# EAGLE design 1 byte input (EAGLE 9.5.0)
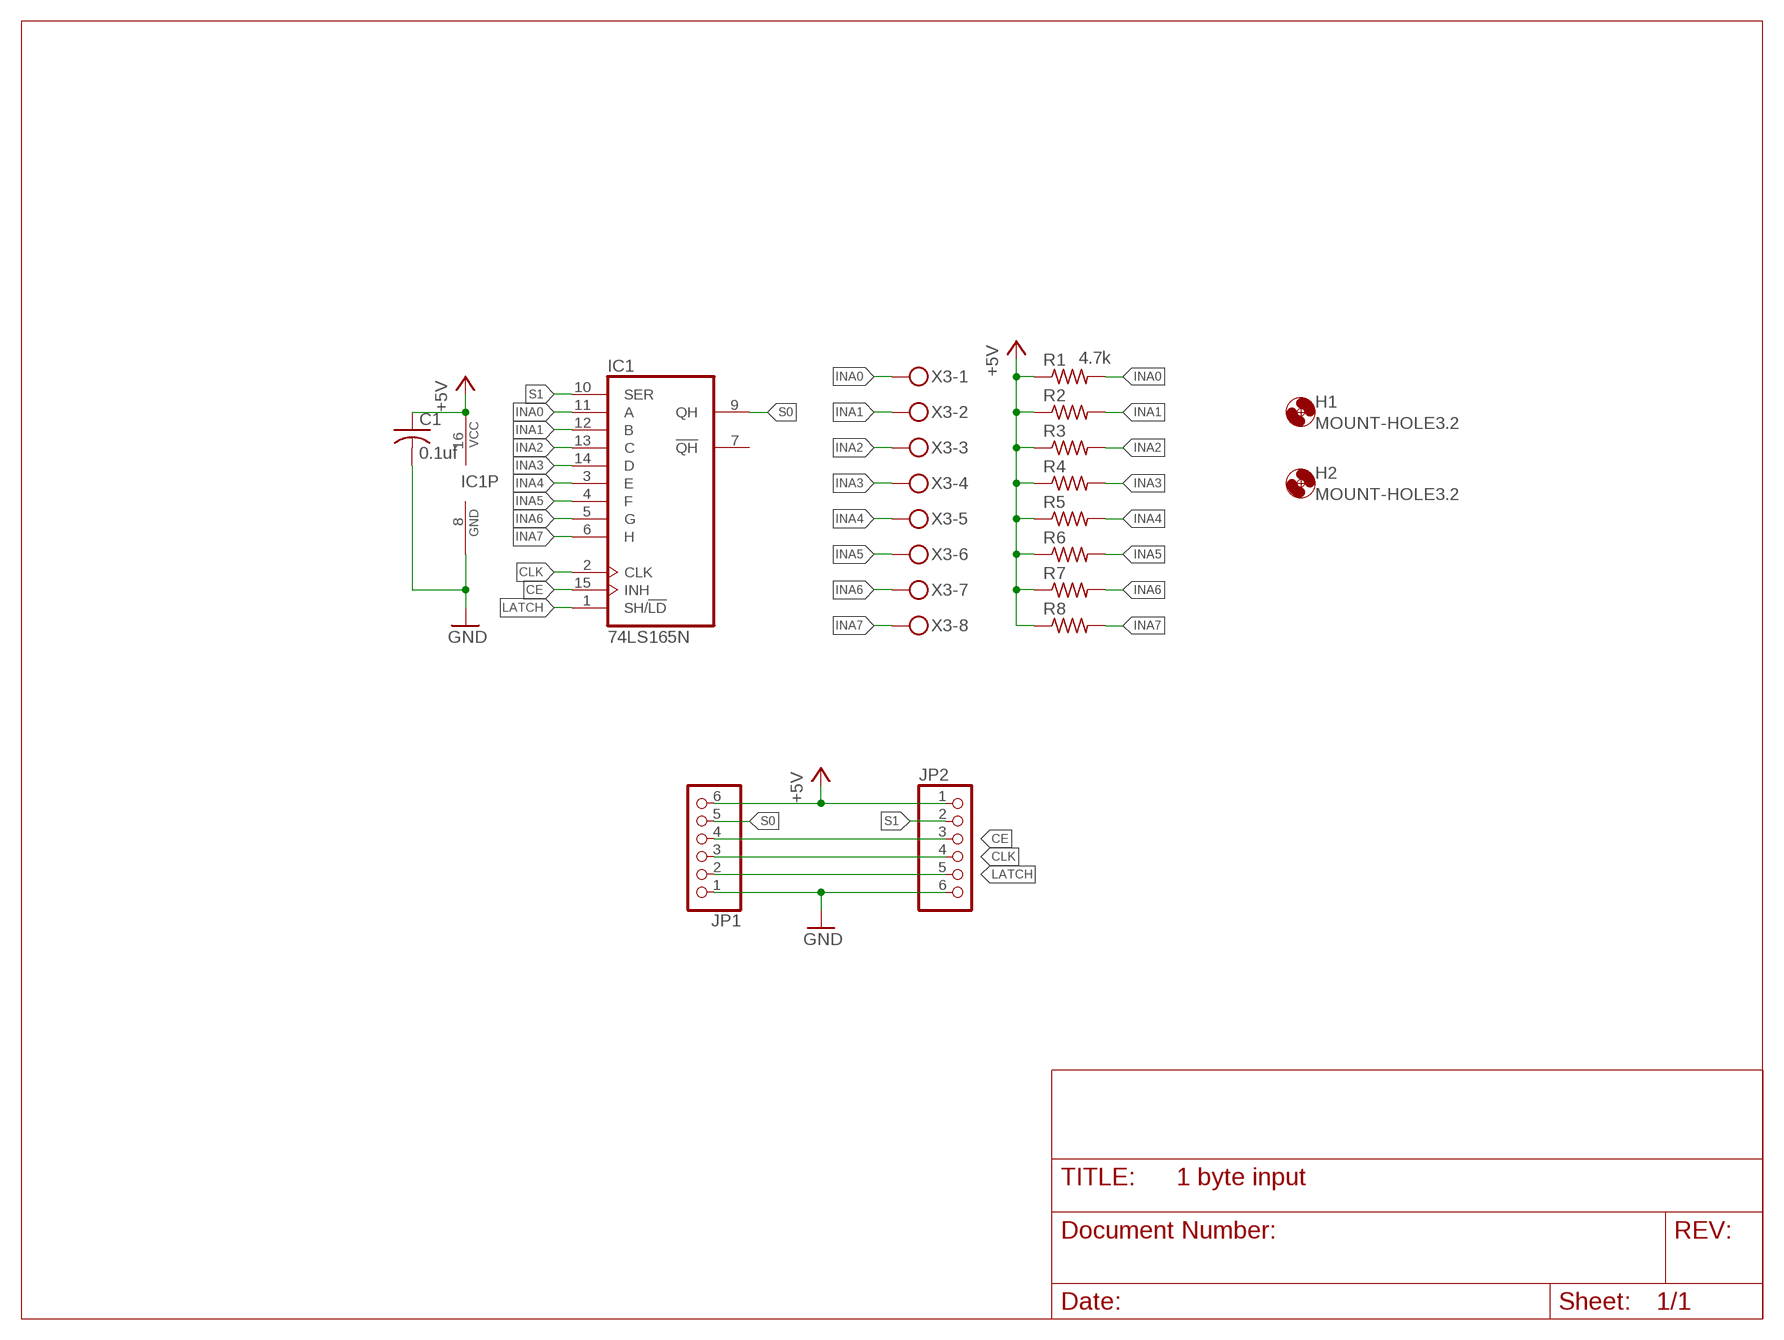
[diagram p0: schematic, sheet 1]

## Parts
C1  0.1uf  C-US025-025X050  [C025-025X050]
H1  MOUNT-HOLE3.2  [3,2]
H2  MOUNT-HOLE3.2  [3,2]
IC1  74LS165N  [DIL16]
JP1  PINHD-1X6/90  [1X06/90]
JP2  PINHD-1X6/90  [1X06/90]
R1  4.7k  R-US_0207/2V  [0207/2V]
R2  R-US_0207/2V  [0207/2V]
R3  R-US_0207/2V  [0207/2V]
R4  R-US_0207/2V  [0207/2V]
R5  R-US_0207/2V  [0207/2V]
R6  R-US_0207/2V  [0207/2V]
R7  R-US_0207/2V  [0207/2V]
R8  R-US_0207/2V  [0207/2V]
X3  MKDSN1,5/8-5,08  [MKDSN1,5/8-5,08]

## Nets
+5V: C1.1 IC1.16(VCC) JP1.6 JP2.1 R1.1 R2.1 R3.1 R4.1 R5.1 R6.1 R7.1 R8.1
CE: IC1.15(INH) JP1.4 JP2.3
CLK: IC1.2(CLK) JP1.3 JP2.4
GND: C1.2 IC1.8(GND) JP1.1 JP2.6
INA0: IC1.11(A) R1.2 X3.1
INA1: IC1.12(B) R2.2 X3.2
INA2: IC1.13(C) R3.2 X3.3
INA3: IC1.14(D) R4.2 X3.4
INA4: IC1.3(E) R5.2 X3.5
INA5: IC1.4(F) R6.2 X3.6
INA6: IC1.5(G) R7.2 X3.7
INA7: IC1.6(H) R8.2 X3.8
LATCH: IC1.1(SH/!LD) JP1.2 JP2.5
S0: IC1.9(QH) JP1.5
S1: IC1.10(SER) JP2.2
Unconnected: IC1.7(!QH)

## Library data of the parts
C1 = resistor:C-US: CAPACITOR, American symbol
H1 H2 = holes:MOUNT-HOLE: MOUNTING HOLE with drill center marker
IC1 = 74xx-us:74*165: 8-bit parallel load SHIFT REGISTER
JP1 JP2 = pinhead:PINHD-1X6: PIN HEADER
R1-R8 = resistor:R-US_: RESISTOR, American symbol
X3 = con-phoenix-508:MKDSN1,5/8-5,08: MKDSN 1,5/ 8-5,08 Printklemme Nennstrom: 13,5 A Nennspannung: 250 V Rastermaß: 5,08 mm Polzahl: 8 Anschlussart: Schraubanschluss Montage: Löten Anschlussrichtung Leiter/Platine: 0 ° Artikelnummer: 1729186 Source: http://eshop.phoenixcontact.com .. 1729186.pdf

## Board
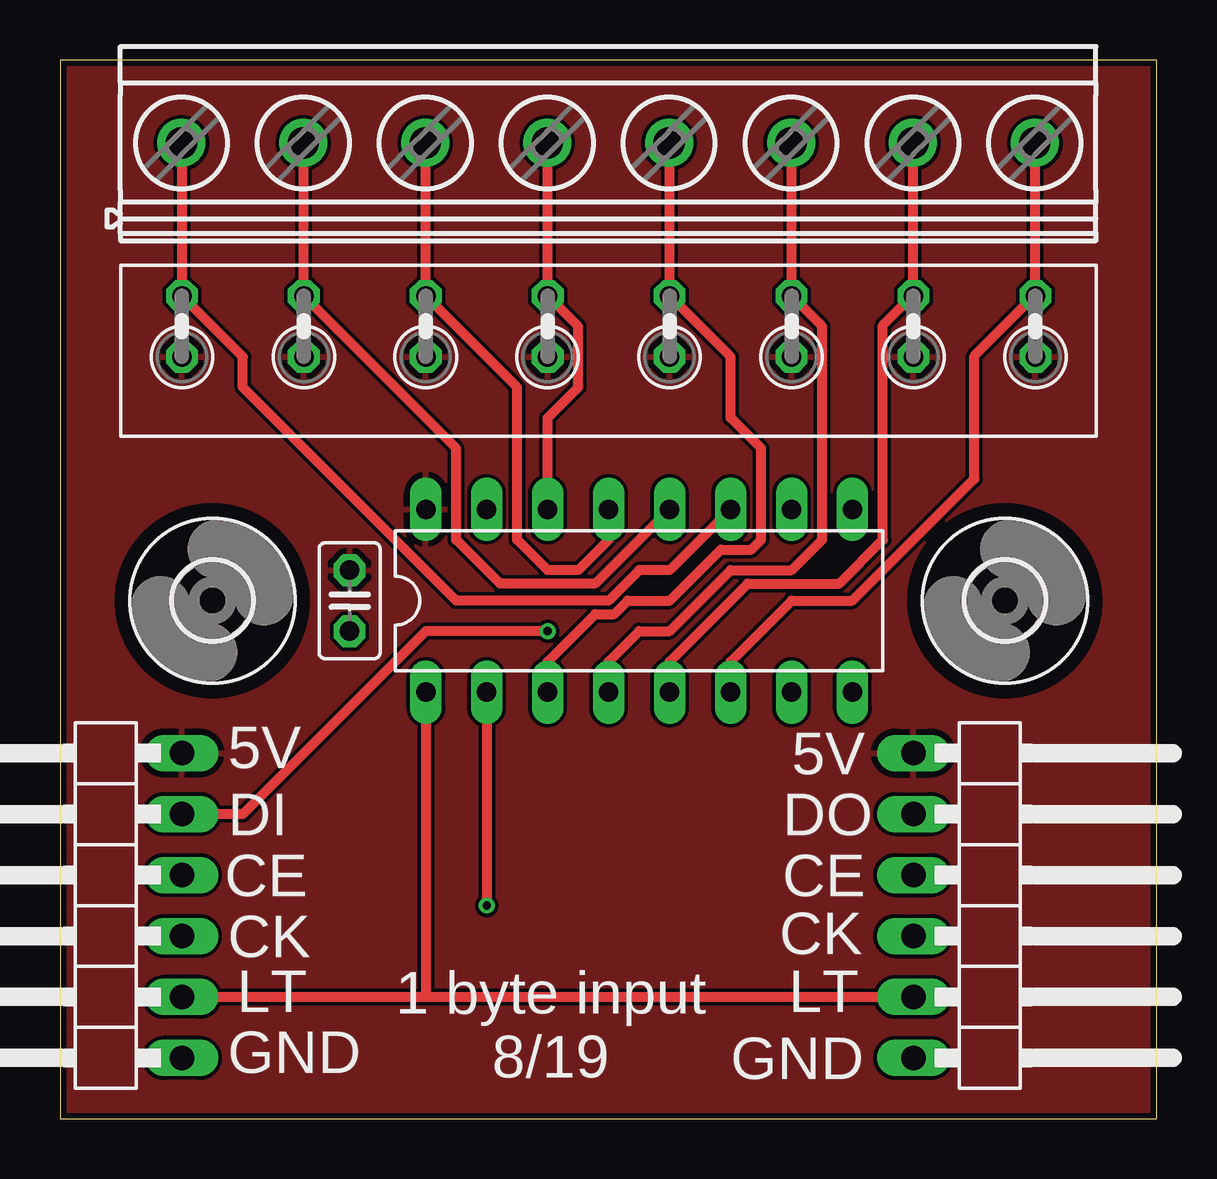
[diagram p1: board, top side]
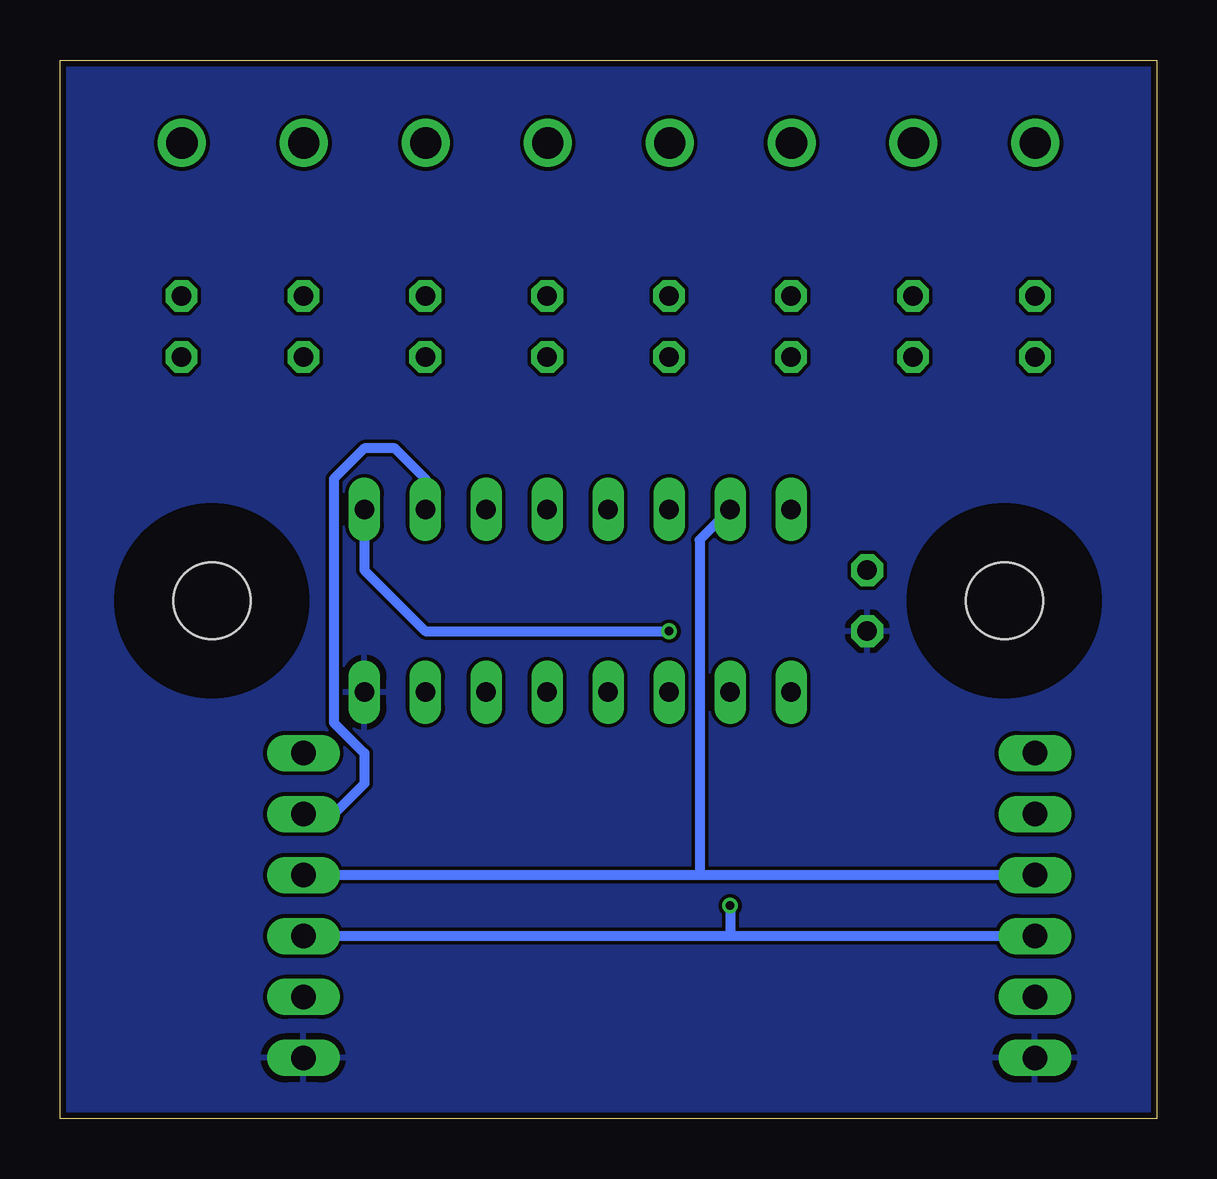
[diagram p2: board, bottom side, seen from below]

Size 45.7 x 44.12 mm. Coordinates in mm from the lower left corner, seen from the top.
Outline: 0,0 45.7,0 45.7,44.12 0,44.12 0,0
Copper layers (1*16): Top 0.035mm / dielectric 1.5mm / Bottom 0.035mm
Design rules "SeeedStudio_2layer": minimum track width 6mil, minimum drill 12mil, track to track 6mil, track to pad 6mil, pad to pad 6mil, via to via 6mil, smd to smd 0mil, copper to edge 10mil, drill to drill 10mil, minimum pad ring 10mil, minimum via ring 6mil, stop-mask expansion 2mil, vias tented up to drill 100mil, thermal gap 10mil

### Footprints (pad centres in the part's own frame; a part is rotated, then mirrored left to right if it is on the bottom)
C025-025X050 = drill 0.813 octagon: 1 -1.27,0; 2 1.27,0
3,2 = hole 3.2: 0,0
DIL16 = drill 0.813 long: 1 -8.89,-3.81; 2 -6.35,-3.81; 3 -3.81,-3.81; 4 -1.27,-3.81; 5 1.27,-3.81; 6 3.81,-3.81; 7 6.35,-3.81; 8 8.89,-3.81; 9 8.89,3.81; 10 6.35,3.81; 11 3.81,3.81; 12 1.27,3.81; 13 -1.27,3.81; 14 -3.81,3.81; 15 -6.35,3.81; 16 -8.89,3.81
1X06/90 = drill 1.016 long: 1 -6.35,-3.81; 2 -3.81,-3.81; 3 -1.27,-3.81; 4 1.27,-3.81; 5 3.81,-3.81; 6 6.35,-3.81
0207/2V = drill 0.813 octagon: 1 -1.27,0; 2 1.27,0
MKDSN1,5/8-5,08 = drill 1.3 pad 2: 1 -17.801,0.025; 2 -12.721,0.025; 3 -7.641,0.025; 4 -2.561,0.025; 5 2.519,0.025; 6 7.599,0.025; 7 12.679,0.025; 8 17.759,0.025

### Placement (x,y rotation side)
C1  12.06,21.59 270 top
H1  6.35,21.59 0 top
H2  39.37,21.59 0 top
IC1  24.13,21.59 0 top
JP1  1.27,8.89 90 top
JP2  39.37,8.89 270 top
R1  5.08,33.02 90 top
R2  10.16,33.02 90 top
R3  15.24,33.02 90 top
R4  20.32,33.02 90 top
R5  25.4,33.02 90 top
R6  30.48,33.02 90 top
R7  35.56,33.02 90 top
R8  40.64,33.02 90 top
X3  22.86,40.64 0 top

### Tracks (layer width: path | path; a pad name or v marks a point on that pad's centre or on a via)
+5V
  pour Top: -2.54,48.26 49.53,48.26 49.53,-1.27 -1.27,-1.27 -2.54,0
CE
  Bottom 0.406: JP1.4 19.05,10.16 | 19.05,10.16 JP2.3 | IC1.15 19.05,24.13 19.05,10.16
CLK  (via drill 0.35)
  Top 0.406: IC1.2 v17.78,8.89
  Bottom 0.406: JP1.3 17.78,7.62 | 17.78,7.62 JP2.4 | v17.78,8.89 17.78,7.62
GND
  pour Bottom: -2.54,46.99 48.26,46.99 48.26,-1.27 -2.54,-1.27
INA0
  Top 0.406: X3.1 5.08,40.64 R1.2 7.62,31.75 7.62,30.48 16.51,21.59 22.86,21.59 24.13,22.86 25.4,22.86 IC1.11
INA1
  Top 0.406: X3.2 10.14,34.31 R2.2 16.51,27.94 16.51,24.13 18.34,22.3 22.3,22.3 IC1.12
INA2
  Top 0.406: X3.3 15.22,34.31 R3.2 19.05,30.48 19.05,24.13 20.32,22.86 21.59,22.86 22.86,24.13 IC1.13
INA3
  Top 0.406: X3.4 20.3,34.31 R4.2 21.59,33.02 21.59,30.48 20.32,29.21 IC1.14
INA4
  Top 0.406: X3.5 25.38,34.31 R5.2 27.94,31.75 27.94,29.21 29.21,27.94 29.21,24.13 28.8,23.72 27.53,23.72 25.4,21.59 23.65,21.59 23.09,21.03 22.3,21.03 20.32,19.05 IC1.3
INA5
  Top 0.406: X3.6 30.46,34.31 R6.2 31.75,33.02 31.75,24.13 30.48,22.86 27.94,22.86 25.4,20.32 24.13,20.32 22.86,19.05 IC1.4
INA6
  Top 0.406: X3.7 35.54,34.31 | 35.54,34.31 R7.2 | IC1.5 25.4,19.05 28.65,22.3 32.46,22.3 34.29,24.13 34.29,33.06 35.54,34.31
INA7
  Top 0.406: X3.8 40.62,34.31 | 40.62,34.31 R8.2 | IC1.6 27.94,19.05 30.48,21.59 33.02,21.59 38.1,26.67 38.1,31.79 40.62,34.31
LATCH
  Top 0.406: JP1.2 15.24,5.08 | 15.24,5.08 JP2.5 | IC1.1 15.24,5.08
S0  (via drill 0.35)
  Top 0.406: v20.32,20.32 15.24,20.32 7.62,12.7 JP1.5
  Bottom 0.406: IC1.9 33.02,22.86 30.48,20.32 v20.32,20.32
S1
  Bottom 0.406: IC1.10 30.48,26.67 31.75,27.94 33.02,27.94 34.29,26.67 34.29,16.51 33.02,15.24 33.02,13.97 34.29,12.7 JP2.2

### Text on the board
tNames: 5V | 5V | DI | DO | CE | CE | CK | CK | LT | 1 byte input / 8/19 | LT | GND | GND
tValues: 4k7